# EAGLE schematic Project7 Schematic (EAGLE 7.2.0)
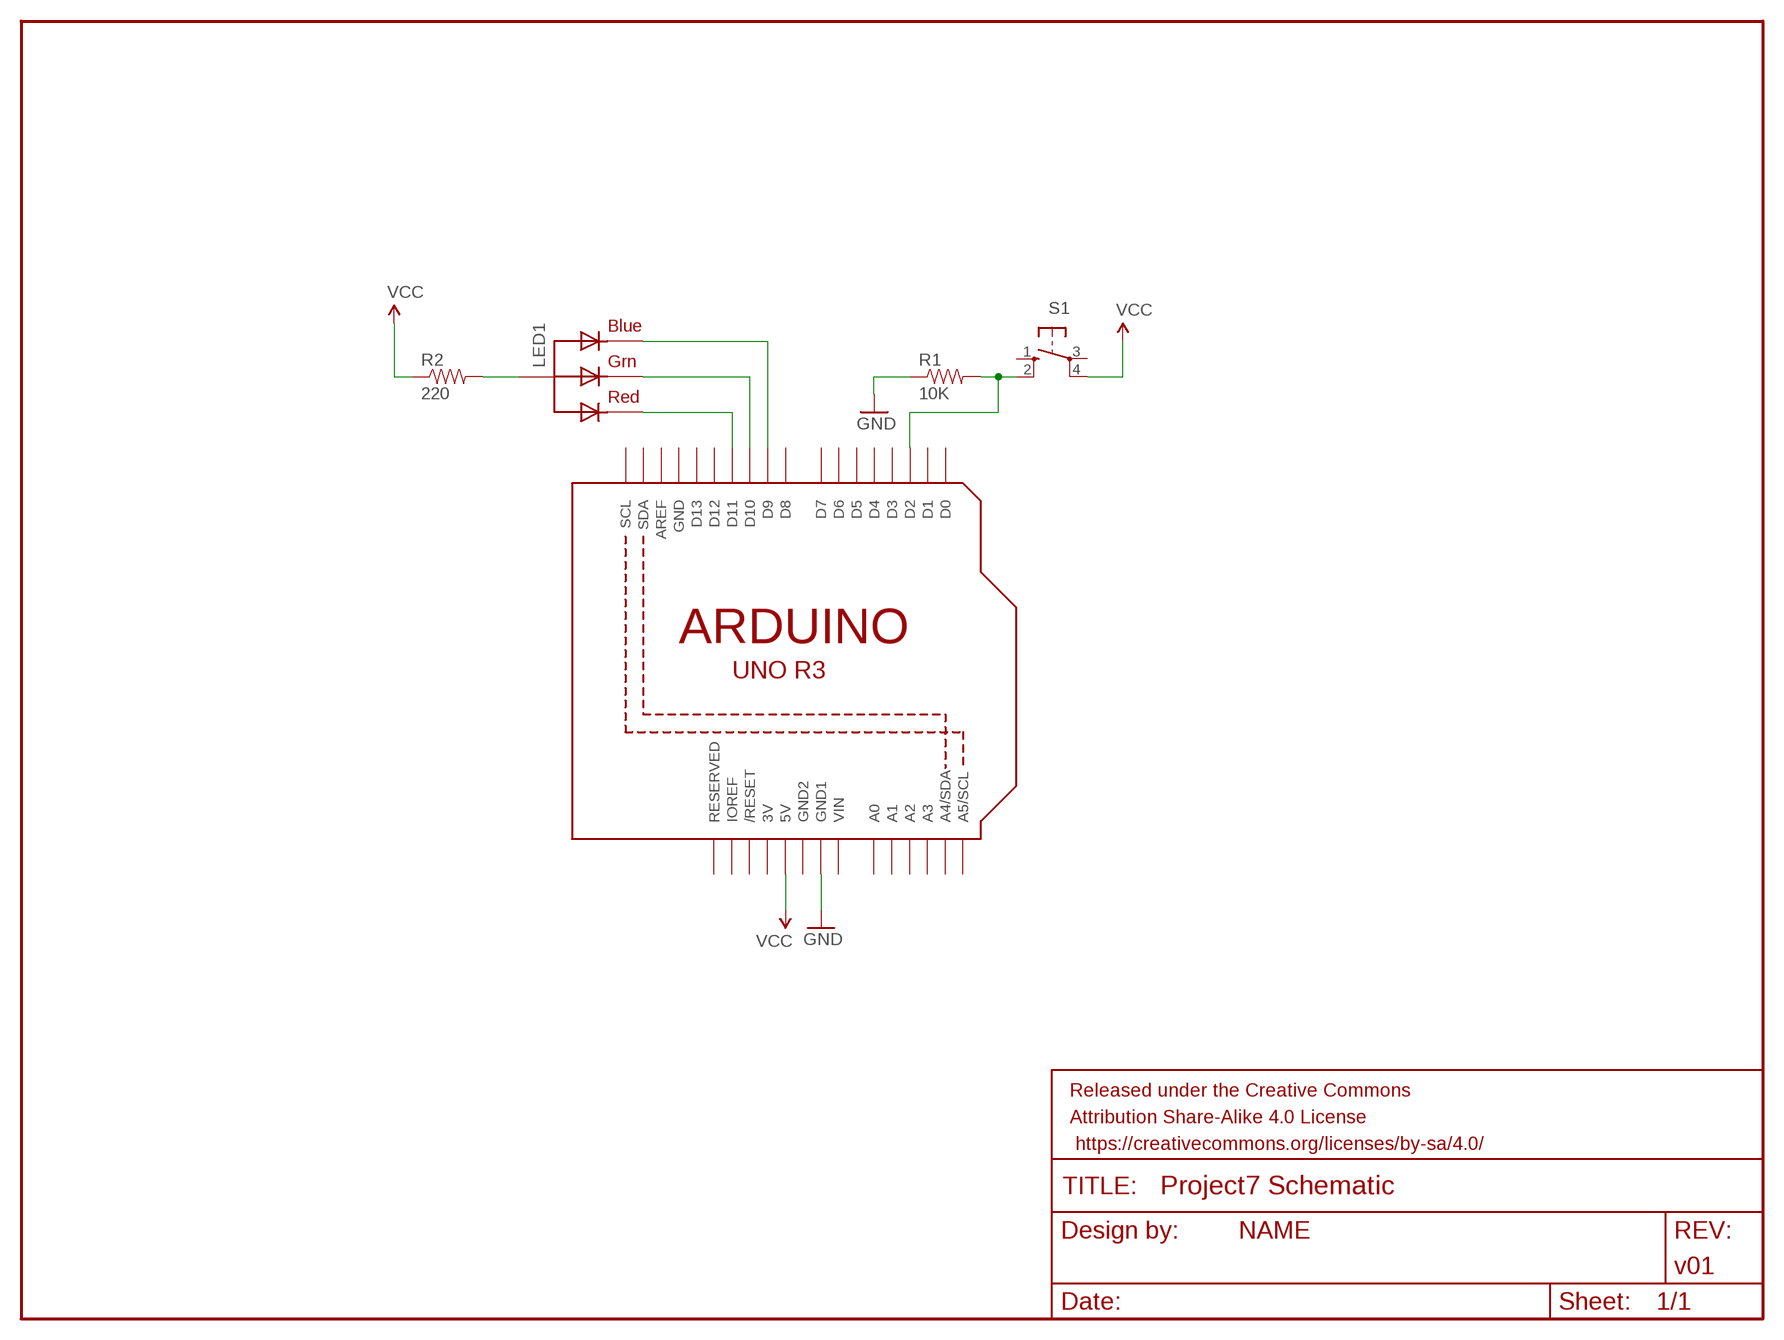
[diagram p0: schematic, sheet 1]

## Parts
FRAME1  FRAME-LETTER  [CREATIVE_COMMONS]
LED1  RGBLED_CA-5MM  [LED5MMRGB]
R1  10K  RESISTOR0402-RES  [0402-RES]
R2  220  RESISTOR0402-RES  [0402-RES]
S1  40-XX  [B3F-40XX]
U1  ARDUINOR3-BPLACE  [ARDUINOR3-BPLACE]

## Nets
GND: R1.1 U1.GND1
N$1: LED1.1(RED) U1.D11
N$2: LED1.3(GREEN) U1.D10
N$3: LED1.4(BLUE) U1.D9
N$4: LED1.2(VCC) R2.2
N$5: R1.2 S1.2(S1) U1.D2
VCC: R2.1 S1.4(P1) U1.5V
Unconnected: S1.1(S) S1.3(P) U1.A0 U1.A1 U1.A2 U1.A3 U1.A4(A4/SDA) U1.A5(A5/SCL) U1.AREF U1.D0 U1.D1 U1.D3 U1.D4 U1.D5 U1.D6 U1.D7 U1.D8 U1.D12 U1.D13 U1.IOREF U1.RESERVED U1.RESET(/RESET) U1.SCL U1.SDA

## Power pins joined to a net without a drawn wire
3V: U1.3V
GND: U1.GND
GND2: U1.GND2
VIN: U1.VIN

## Library data of the parts
FRAME1 = SparkFun-Aesthetics:FRAME-LETTER: Schematic Frame Standard 8.5x11 US Letter frame; DESIGNER: NAME; VERSION: v01
LED1 = adafruit:RGBLED_CA: RGB LED, common-anode 5MM Staggered pins 5mm Piranha package http://www.ladyada.net/library/pcb/eaglelibrary.html
R1 R2 = SparkFun-Passives:RESISTOR: Resistor Basic schematic elements and footprints for 0603, 1206, and PTH resistors.
S1 = adafruit:40-XX: OMRON SWITCH; MF: OMRON COMPONENTS USA; MPN: B3F-4000; OC_FARNELL: 176434; OC_NEWARK: 36K3105
U1 = adafruit:ARDUINOR3: This is a new object for the new Arduino R3 - with extra pins that you may want to use (such as IOref, and duplicated A4/A5